# EAGLE schematic lcd_duffle_pth_mk_3 (EAGLE 6.5.0)
LCD Dufflebag Ride-along I2C interface for a standard LCD screen, including RGB support. Uses an ATTiny84 plus WS2811 (for backlight control). This is the PTH version
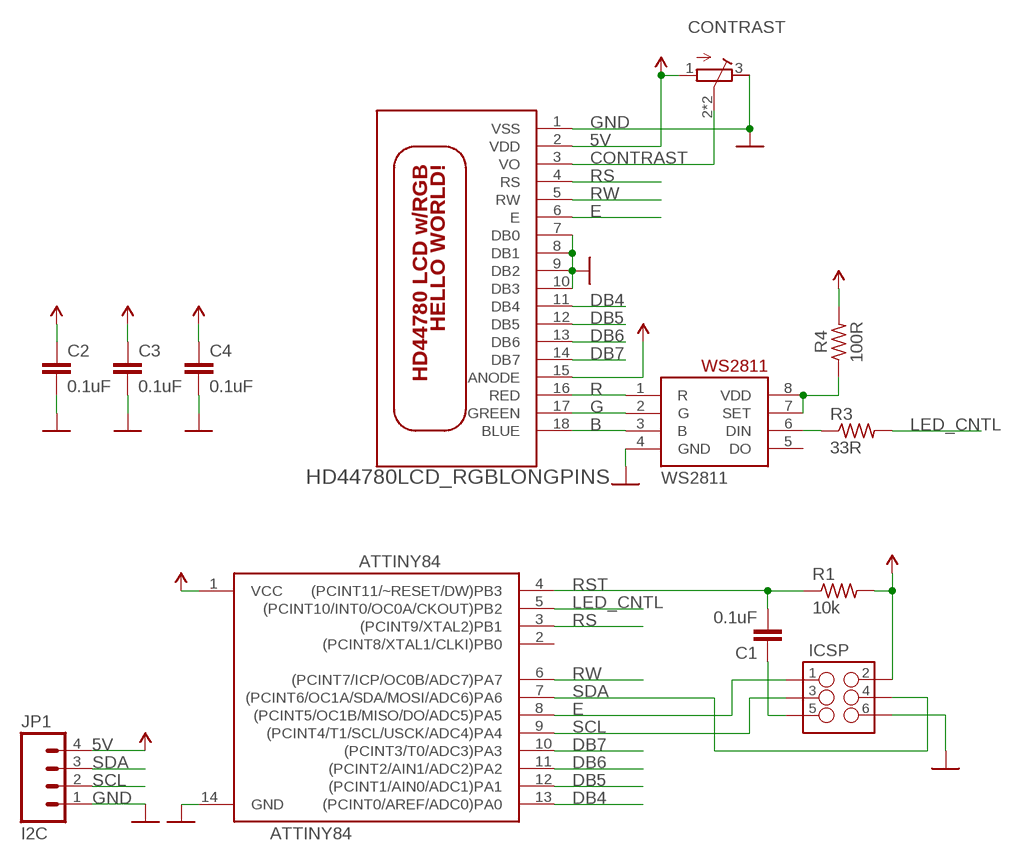
[diagram p0: schematic, sheet 1]

## Parts
ATTINY84  ATTINY84  [SO14]
C1  0.1uF  CAPACITOR-CERAMIC025-024X044  [C025-024X044]
C2  0.1uF  CAPACITOR-CERAMIC025-024X044  [C025-024X044]
C3  0.1uF  CAPACITOR-CERAMIC025-024X044  [C025-024X044]
C4  0.1uF  CAPACITOR-CERAMIC025-024X044  [C025-024X044]
CONTRAST  POTENTIOMETERTHUMBWHEEL-16MM  [POT-THUMBWHEEL]
ICSP  M03X2POGO_PINS  [2X3_POGO]
JP1  I2C  M04-2.5MM_JST_XH_RA  [1X04-2.5MM_JST_XH_RA]
R1  10k  RESISTORPTH-AXIAL-5.08MM  [RESISTOR-AXIAL-PTH-5.08MM]
R3  33R  RESISTORPTH-AXIAL-5.08MM  [RESISTOR-AXIAL-PTH-5.08MM]
R4  100R  RESISTORPTH-AXIAL-5.08MM  [RESISTOR-AXIAL-PTH-5.08MM]
U$1  HD44780LCD_RGBLONGPINS  [LCD1602-RGB-CENTERED]
WS2811  WS2811-SOP8  [SO08-SKINNYPADS]

## Nets
5V: ATTINY84.1(VCC) C2.2 C3.2 C4.2 CONTRAST.1(A) ICSP.P$2 JP1.4 R1.P$2 R4.P$2 U$1.2(VDD) U$1.15(ANODE)
B: U$1.18(BLUE) WS2811.3(B)
CONTRAST: CONTRAST.2(S) CONTRAST.2@1(S) U$1.3(VO)
DB4: ATTINY84.13((PCINT0/AREF/ADC0)PA0) U$1.11(DB4)
DB5: ATTINY84.12((PCINT1/AIN0/ADC1)PA1) U$1.12(DB5)
DB6: ATTINY84.11((PCINT2/AIN1/ADC2)PA2) U$1.13(DB6)
DB7: ATTINY84.10((PCINT3/T0/ADC3)PA3) U$1.14(DB7)
E: ATTINY84.8((PCINT5/OC1B/MISO/DO/ADC5)PA5) ICSP.P$1 U$1.6(E)
G: U$1.17(GREEN) WS2811.2(G)
GND: ATTINY84.14(GND) C2.1 C3.1 C4.1 CONTRAST.3(E) ICSP.P$6 JP1.1 U$1.1(VSS) U$1.7(DB0) U$1.8(DB1) U$1.9(DB2) U$1.10(DB3) WS2811.4(GND)
LED_CNTL: ATTINY84.5((PCINT10/INT0/OC0A/CKOUT)PB2) R3.P$2
N$1: R3.P$1 WS2811.6(DIN)
N$2: R4.P$1 WS2811.7(SET) WS2811.8(VDD)
N$3: C1.1 ICSP.P$5
R: U$1.16(RED) WS2811.1(R)
RS: ATTINY84.3((PCINT9/XTAL2)PB1) U$1.4(RS)
RST: ATTINY84.4((PCINT11/~RESET/DW)PB3) C1.2 R1.P$1
RW: ATTINY84.6((PCINT7/ICP/OC0B/ADC7)PA7) U$1.5(RW)
SCL: ATTINY84.9((PCINT4/T1/SCL/USCK/ADC4)PA4) ICSP.P$3 JP1.2
SDA: ATTINY84.7((PCINT6/OC1A/SDA/MOSI/ADC6)PA6) ICSP.P$4 JP1.3
Unconnected: ATTINY84.2((PCINT8/XTAL1/CLKI)PB0) WS2811.5(DO)

## Library data of the parts
ATTINY84 = SparkFun-DigitalIC:ATTINY84: Atmel 14-pin 2/4/8kB flash uC
C1-C4 = A_butts:CAPACITOR-CERAMIC: CAPACITOR, European symbol
CONTRAST = A_butts:POTENTIOMETER: Trimm resistor
ICSP = SparkFun-Connectors:M03X2: 2x3 .1" header. Shrouded, with keying- CONN-10681 SMT- CONN-11415 Pogo pins- HW-11044; PROD_ID: HW-11044
JP1 = A_butts:M04: Header 4 Standard 4-pin 0.1" header. Use with straight break away headers (SKU : PRT-00116), right angle break away headers (PRT-00553), swiss pins (PRT-00743), machine pins (PRT-00117), and female headers (PRT-00115). Molex polarized connector foot print use with SKU : PRT-08231 with associated crimp pins and housings. 1MM SMD Version SKU: PRT-10208
R1 R3 R4 = A_butts:RESISTOR: RESISTOR, American symbol
U$1 = A_butts:HD44780LCD_RGB
WS2811 = adafruit:WS2811